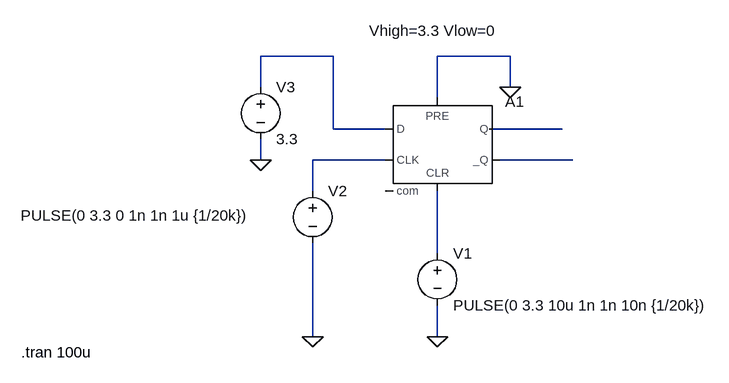
[diagram p0: schematic Draft3.asc]
Draft3.asc, the LTspice schematic file:
Version 4.1
SHEET 1 880 680
WIRE 32 48 -80 48
WIRE 304 48 192 48
WIRE -80 96 -80 48
WIRE 304 96 304 48
WIRE 192 112 192 48
WIRE 32 160 32 48
WIRE 112 160 32 160
WIRE 384 160 272 160
WIRE -80 208 -80 176
WIRE 112 208 0 208
WIRE 400 208 288 208
WIRE 0 256 0 208
WIRE 192 352 192 256
WIRE 0 480 0 336
WIRE 192 480 192 432
FLAG 192 480 0
FLAG 304 96 0
FLAG 0 480 0
FLAG -80 208 0
SYMBOL Digital\\dflop 192 112 R0
WINDOW 39 -105 -103 Left 2
SYMATTR SpiceLine Vhigh=3.3 Vlow=0
SYMATTR InstName A1
SYMBOL voltage 192 336 R0
WINDOW 123 0 0 Left 0
WINDOW 39 0 0 Left 0
SYMATTR InstName V1
SYMATTR Value PULSE(0 3.3 10u 1n 1n 10n {1/20k})
SYMBOL voltage 0 240 R0
WINDOW 3 -449 53 Left 2
WINDOW 123 0 0 Left 0
WINDOW 39 0 0 Left 0
SYMATTR Value PULSE(0 3.3 0 1n 1n 1u {1/20k})
SYMATTR InstName V2
SYMBOL voltage -80 80 R0
WINDOW 123 0 0 Left 0
WINDOW 39 0 0 Left 0
SYMATTR InstName V3
SYMATTR Value 3.3
TEXT -448 504 Left 2 !.tran 100u

The netlist it stands for:
* Draft3.asc
A1 N001 0 N003 0 N005 N004 N002 0 DFLOP Vhigh=3.3 Vlow=0
V1 N005 0 PULSE(0 3.3 10u 1n 1n 10n {1/20k})
V2 N003 0 PULSE(0 3.3 0 1n 1n 1u {1/20k})
V3 N001 0 3.3
.tran 100u
.backanno
.end